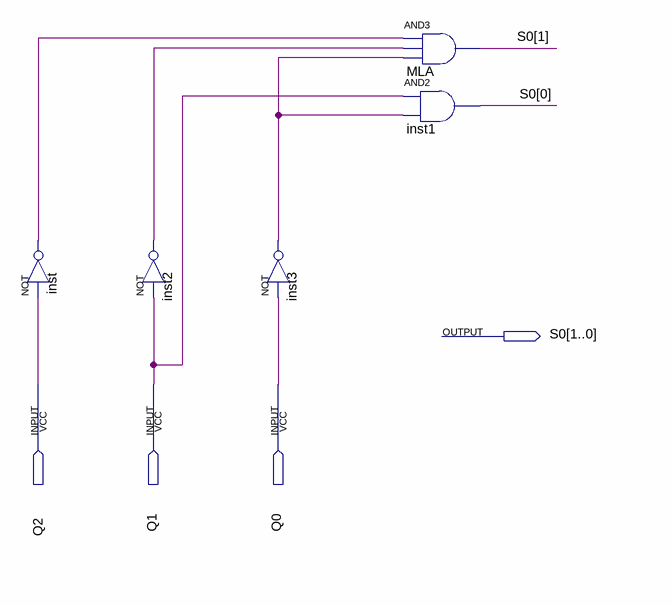
[diagram p0: schematic sheet]
// Quartus schematic S0_C0.bdf as structural Verilog: 5 symbols, 4 pins
module S0_C0 (
  input  Q2,
  input  Q1,
  input  Q0,
  output [1:0] S0
);

  wire inst2_out, inst3_out, inst_out;

  not inst (inst_out, Q2);
  not inst2 (inst2_out, Q1);
  not inst3 (inst3_out, Q0);
  and MLA (S0[1], inst_out, inst2_out, inst3_out);
  and inst1 (S0[0], Q1, inst3_out);
endmodule
